# Altium schematic sheet FiringBoard.SchDoc
size B; PageSetup: Record=PageOptions|CenterHorizontal=True|CenterVertical=True|PrintScale=0.72|XCorrection=1.00|YCorrection=1.00|PrintKind=0|BorderSize=5000000|LeftOffset=0|BottomOffset=0|Orientation=2|PaperLength=1000|PaperWidth=1000|Scale=100|PaperSource=7|PrintQuality=-4|MediaType=1|DitherType=10|PaperKind=Letter|PrintScaleMode=1
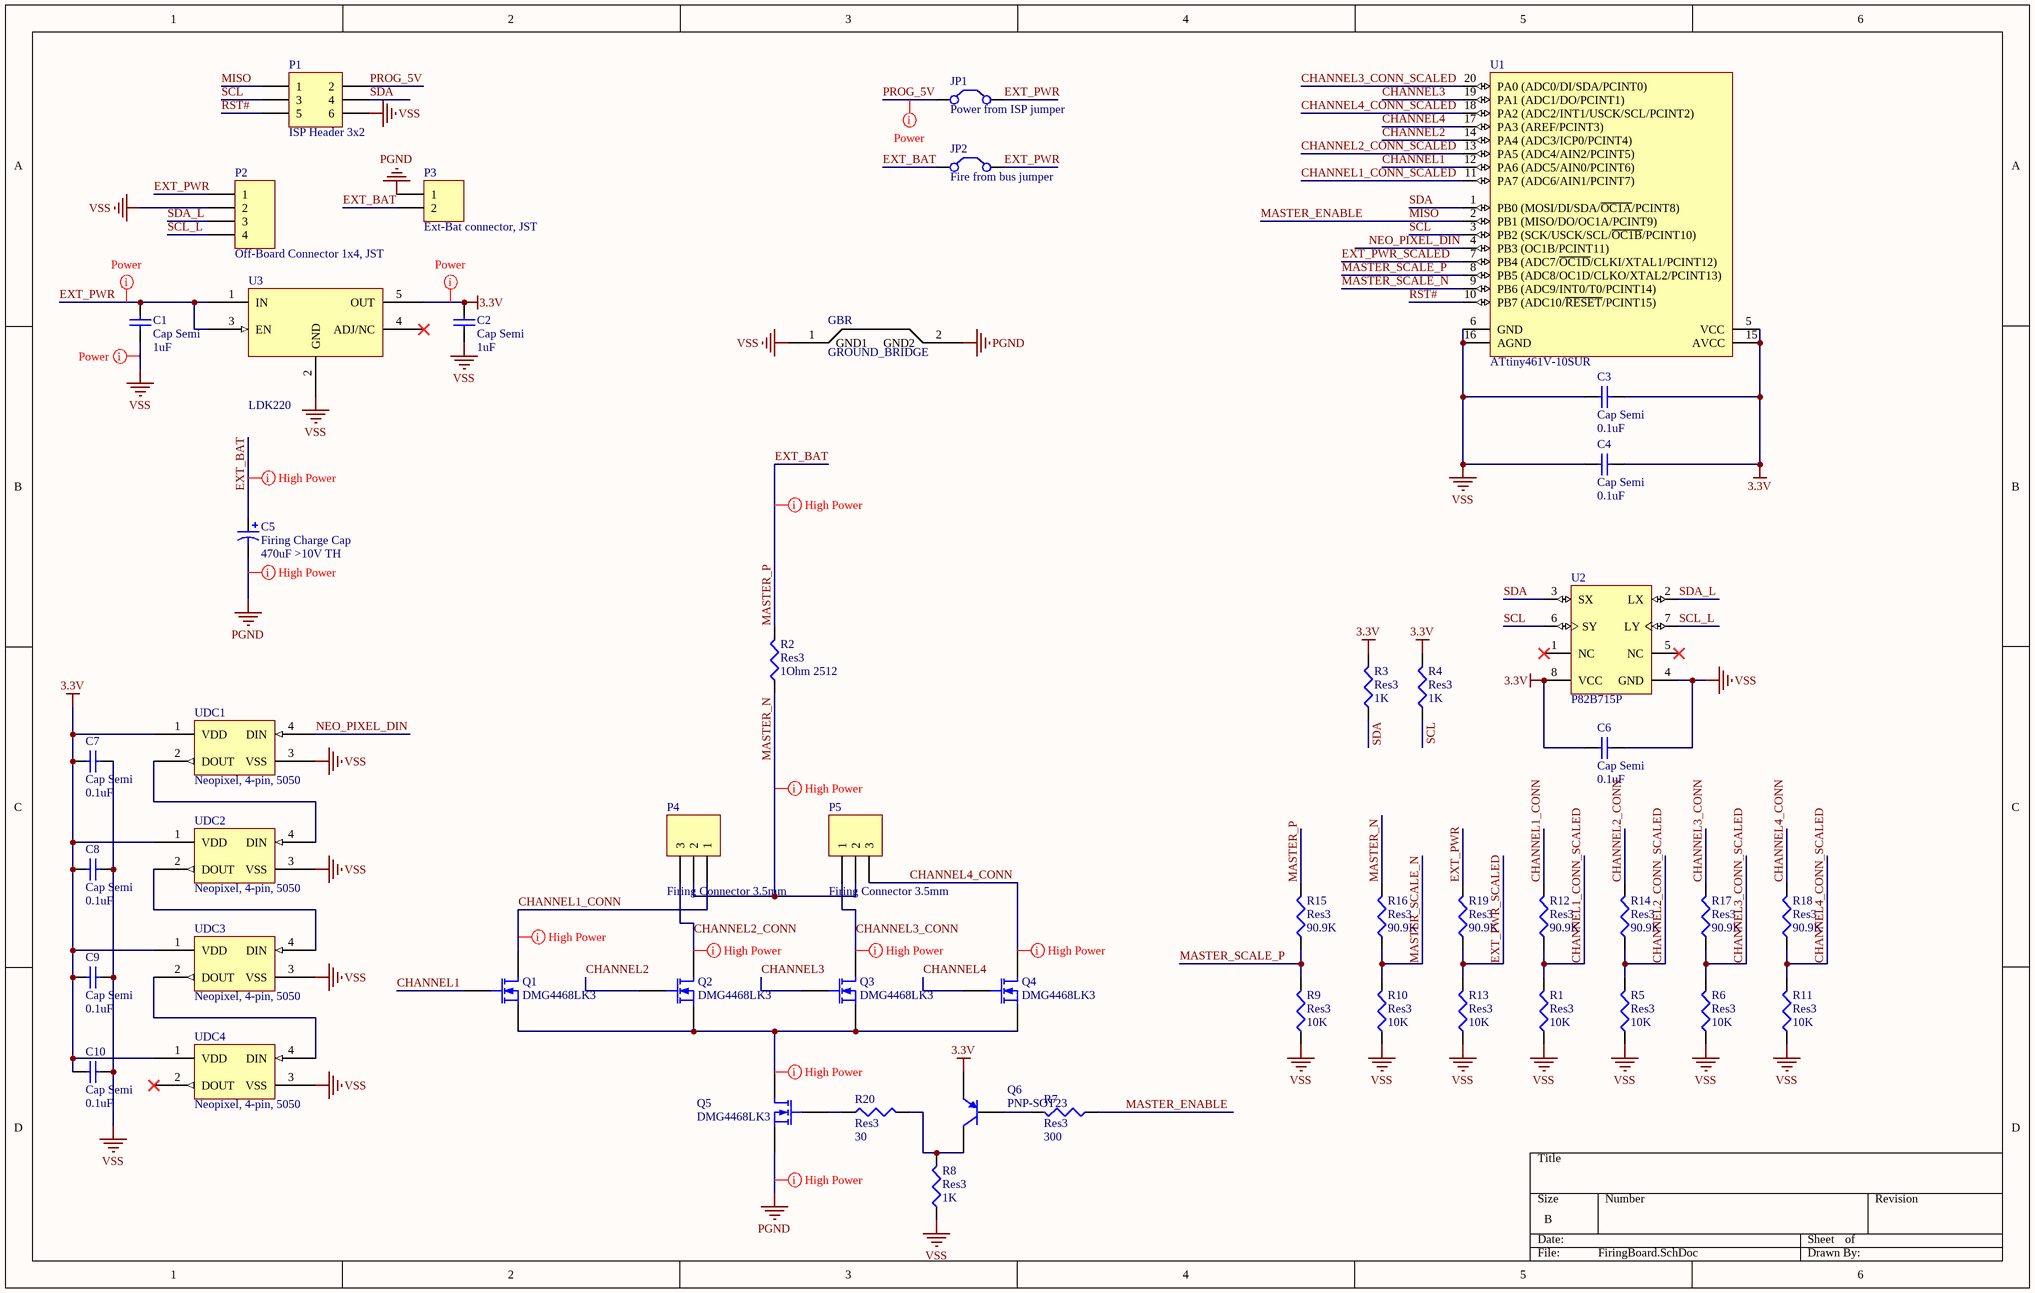
[diagram p0: FiringBoard.SchDoc]

## Parts
C1  Cap Semi  value 1uF  [C0603]
C2  Cap Semi  value 1uF  [C0603]
C3  Cap Semi  value 0.1uF  [C0603]
C4  Cap Semi  value 0.1uF  [C0603]
C5  Firing Charge Cap  value 470uF >10V TH  [CAPPR-10x12.5-Flat-Right]
C6  Cap Semi  value 0.1uF  [C0603]
C7  Cap Semi  value 0.1uF  [C0603]
C8  Cap Semi  value 0.1uF  [C0603]
C9  Cap Semi  value 0.1uF  [C0603]
C10  Cap Semi  value 0.1uF  [C0603]
GBR  GROUND_BRIDGE  [GROUND_BRIDGE]  (net tie, no BOM)
JP1  Power from ISP jumper  [SOLDER-JUMPER-3D]
JP2  Fire from bus jumper  [SOLDER-JUMPER-3D]
P1  ISP Header 3x2  [HDR2X3-AVRISP]
P2  Off-Board Connector 1x4, JST  [1x04-1.5MM-JST]
P3  Ext-Bat connector, JST  [JST-2-PTH-NS]
P4  Firing Connector 3.5mm  [20020327-C031B01LF]
P5  Firing Connector 3.5mm  [20020327-C031B01LF]
Q1  DMG4468LK3  [TO252]
Q2  DMG4468LK3  [TO252]
Q3  DMG4468LK3  [TO252]
Q4  DMG4468LK3  [TO252]
Q5  DMG4468LK3  [TO252]
Q6  PNP-SOT23  [SOT-23B_N]
R1  Res3  value 10K  [R0603-3D]
R2  Res3  value 1Ohm 2512  [R2512]
R3  Res3  value 1K  [R0603-3D]
R4  Res3  value 1K  [R0603-3D]
R5  Res3  value 10K  [R0603-3D]
R6  Res3  value 10K  [R0603-3D]
R7  Res3  value 300  [R0603-3D]
R8  Res3  value 1K  [R0603-3D]
R9  Res3  value 10K  [R0603-3D]
R10  Res3  value 10K  [R0603-3D]
R11  Res3  value 10K  [R0603-3D]
R12  Res3  value 90.9K  [R0603-3D]
R13  Res3  value 10K  [R0603-3D]
R14  Res3  value 90.9K  [R0603-3D]
R15  Res3  value 90.9K  [R0603-3D]
R16  Res3  value 90.9K  [R0603-3D]
R17  Res3  value 90.9K  [R0603-3D]
R18  Res3  value 90.9K  [R0603-3D]
R19  Res3  value 90.9K  [R0603-3D]
R20  Res3  value 30  [R0603-3D]
U1  ATtiny461V-10SUR  [20S2_M]
U2  P82B715P  [SO-G8]
U3  LDK220  [SO-G5/P.95]
UDC1  Neopixel, 4-pin, 5050  [LED5050]
UDC2  Neopixel, 4-pin, 5050  [LED5050]
UDC3  Neopixel, 4-pin, 5050  [LED5050]
UDC4  Neopixel, 4-pin, 5050  [LED5050]

## Nets
3.3V: C2.2 C3.2 C4.2 C6.1 C7.2 C8.2 C9.2 C10.2 Q6.2(E) R3.2 R4.2 U1.5(VCC) U1.15(AVCC) U2.8(VCC) U3.5(OUT) UDC1.1(VDD) UDC2.1(VDD) UDC3.1(VDD) UDC4.1(VDD)
PGND: C5.2 GBR.2(GND2) P3.1 Q5.2(S)
VSS: C1.1 C2.1 C3.1 C4.1 C6.2 C7.1 C8.1 C9.1 C10.1 GBR.1(GND1) P1.6 P2.2 R1.1 R5.1 R6.1 R8.1 R9.1 R10.1 R11.1 R13.1 U1.6(GND) U1.16(AGND) U2.4(GND) U3.2(GND) UDC1.3(VSS) UDC2.3(VSS) UDC3.3(VSS) UDC4.3(VSS)
CHANNEL1: Q1.1(G) U1.12(PA6_(ADC5/AIN0/PCINT6))
CHANNEL1_CONN: P4.1 Q1.3(D) R12.2
CHANNEL1_CONN_SCALED: R1.2 R12.1 U1.11(PA7_(ADC6/AIN1/PCINT7))
CHANNEL2: Q2.1(G) U1.14(PA4_(ADC3/ICP0/PCINT4))
CHANNEL2_CONN: P4.3 Q2.3(D) R14.2
CHANNEL2_CONN_SCALED: R5.2 R14.1 U1.13(PA5_(ADC4/AIN2/PCINT5))
CHANNEL3: Q3.1(G) U1.19(PA1_(ADC1/DO/PCINT1))
CHANNEL3_CONN: P5.1 Q3.3(D) R17.2
CHANNEL3_CONN_SCALED: R6.2 R17.1 U1.20(PA0_(ADC0/DI/SDA/PCINT0))
CHANNEL4: Q4.1(G) U1.17(PA3_(AREF/PCINT3))
CHANNEL4_CONN: P5.3 Q4.3(D) R18.2
CHANNEL4_CONN_SCALED: R11.2 R18.1 U1.18(PA2_(ADC2/INT1/USCK/SCL/PCINT2))
EXT_BAT: C5.1 JP2.1(C1) P3.2 R2.2 R15.2  [also labelled MASTER_P]
EXT_PWR: C1.2 JP1.2(C2) JP2.2(C2) P2.1 R19.2 U3.1(IN) U3.3(EN)
EXT_PWR_SCALED: R13.2 R19.1 U1.7(PB4_(ADC7/~{OC1D}/CLKI/XTAL1/PCINT12))
MASTER_ENABLE: P1.1 R7.1 U1.2(PB1_(MISO/DO/OC1A/PCINT9))  [also labelled MISO]
MASTER_N: P4.2 P5.2 R2.1 R16.2
MASTER_SCALE_N: R10.2 R16.1 U1.9(PB6_(ADC9/INT0/T0/PCINT14))
MASTER_SCALE_P: R9.2 R15.1 U1.8(PB5_(ADC8/OC1D/CLKO/XTAL2/PCINT13))
NEO_PIXEL_DIN: U1.4(PB3_(OC1B/PCINT11)) UDC1.4(DIN)
PROG_5V: JP1.1(C1) P1.2
RST#: P1.5 U1.10(PB7_(ADC10/~{RESET}/PCINT15))
SCL: P1.3 R4.1 U1.3(PB2_(SCK/USCK/SCL/~{OC1B}/PCINT10)) U2.6(SY)
SCL_L: P2.4 U2.7(LY)
SDA: P1.4 R3.1 U1.1(PB0_(MOSI/DI/SDA/~{OC1A}/PCINT8)) U2.3(SX)
SDA_L: P2.3 U2.2(LX)
NetQ1_2: Q1.2(S) Q2.2(S) Q3.2(S) Q4.2(S) Q5.3(D)
NetQ5_1: Q5.1(G) R20.1
NetQ6_1: Q6.1(B) R7.2
NetQ6_3: Q6.3(C) R8.2 R20.2
NetUDC1_2: UDC1.2(DOUT) UDC2.4(DIN)
NetUDC2_2: UDC2.2(DOUT) UDC3.4(DIN)
NetUDC3_2: UDC3.2(DOUT) UDC4.4(DIN)

Not connected (* = marked no-connect by the designer): U2 1(NC)* 5(NC)*; U3 4(ADJ/NC)*; UDC4 2(DOUT)*

## Layout directives
net class High Power: CHANNEL1_CONN, CHANNEL2_CONN, CHANNEL3_CONN, CHANNEL4_CONN, EXT_BAT, MASTER_N, NetQ1_2, PGND
net class Power: 3.3V, EXT_PWR, PROG_5V, VSS

## Library data of the parts
C1-C4 C6-C10 = Cap Semi: Capacitor (Semiconductor SIM Model); Published: 8-Jun-2000; LatestRevisionDate: 29-May-2009; LatestRevisionNote: IPC-7351 Footprint Added.; PackageReference: C1206; Publisher: Altium Limited; PackageDescription: Chip Capacitor
C5 = Cap Pol1: Polarized Capacitor (Radial); Published: 8-Jun-2000; LatestRevisionDate: 17-Jul-2002; LatestRevisionNote: Re-released for DXP Platform.; PackageReference: RB7.6-15; Publisher: Altium Limited; PackageDescription: Polarized Capacitor (Radial); 2 Leads
JP1 JP2 = SolderJumper: Solder Configuration Jumper; Published: 24-Mar-1999; LatestRevisionDate: 17-Jul-2002; LatestRevisionNote: Re-released for DXP Platform.; PackageReference: RAD-0.2; Publisher: Altium Limited; PackageDescription: Radial Cap, Thru-Hole; 2 Leads; 0.2 in Pin Spacing
P1 = Header 3X2: Header, 3-Pin, Dual row; LatestRevisionDate: 17-Jul-2002; LatestRevisionNote: Re-released for DXP Platform.; Publisher: Altium Limited
P2 = Header 4: Header, 4-Pin; LatestRevisionDate: 17-Jul-2002; LatestRevisionNote: Re-released for DXP Platform.; Publisher: Altium Limited
P3 = Header 2: Header, 2-Pin; LatestRevisionDate: 17-Jul-2002; LatestRevisionNote: Re-released for DXP Platform.; Publisher: Altium Limited
P4 P5 = Header 3: Header, 3-Pin; LatestRevisionDate: 17-Jul-2002; LatestRevisionNote: Re-released for DXP Platform.; Publisher: Altium Limited
Q1-Q5 = DMG4468LK3: N-CHANNEL ENHANCEMENT MODE MOSFET; LatestRevisionDate: 17-Jul-2002; LatestRevisionNote: Re-released for DXP Platform.; PackageVersion: 1995/1996; PackageReference: E3; PackageDescription: TO252
Q6 = PNP-SOT23: PNP Bipolar Transistor - SOT23; Published: 8-Jun-2000; LatestRevisionDate: 29-May-2009; LatestRevisionNote: IPC-7351 Footprint Added.; PackageVersion: Aug-1999; PackageReference: SOT-23B; Publisher: Altium Limited; PackageDescription: 3-Pin SOT-23 Package 0.95 mm Pitch, 2.4 mm Lead Span
R1-R20 = Res3: Resistor; Published: 8-Jun-2000; LatestRevisionDate: 29-May-2009; LatestRevisionNote: IPC-7351 Footprint Added.; PackageReference: J1-0603; Publisher: Altium Limited; PackageDescription: Chip Resistor
U1 = CMP-0093-00289-1: 8-bit AVR Microcontroller, 1.8-5.5V, 10MHz, 4KB Flash, 256 Bytes EEPROM, 256 Bytes SRAM, 20-pin SOIC, Industrial Grade (-40°C to 85°C), Reel; ComponentLink1URL: http://www.atmel.com/; ComponentLink1Description: Manufacturer URL; PackageDescription: 20-lead, 0.300" Wide Body, Plastic Gull Wing Small Outline Package (SOIC); DatasheetVersion: revE, Aug-2010; ComponentLink2Description: ATtiny261/461/861 Datasheet; Code_IPC: SOIC127P1030-20; ComponentLink3URL: http://www.atmel.com/dyn/resources/prod_documents/2588S.pdf; PackageReference: 20S2; PackageVersion: revB, Nov-2006; ComponentLink3Description: ATtiny261/461/861 Summary; ComponentLink2URL: http://www.atmel.com/dyn/resources/prod_documents/doc2588.pdf; Code_JEDEC: MS-013-AC
U2 = CMP-0314-00015-1: I2C Bus Extender, 2 Channel Width, 3.0 to 12.0 V, -40 to 85 degC, 8-pin PDIP (P), Pb-Free (RoHS); Manufacturer: Texas Instruments; Channel Width: 2; Open Drain I/O Type: Yes; VCC(Min)(V): 3; VCC(Max)(V): 12; Eco-Plan: Green (RoHS & no Sb/Br); SubFamily: I2C Hub, Buffer, Repeater; Master Side I2C Bus Capacitance Supported(pF): 400; ComponentLink1Description: Datasheet; PackageDescription: 8-Pin Plastic Dual-In-Line Package, Row Spacing 7.62 mm, Pitch 2.54 mm; Mounting Technology: Through-hole; PartNumber: P82B715P; DatasheetVersion: SCPS145A; Vcc range(V): 3.0 to 12.0; ComponentLink2URL: http://www.ti.com/litv/pdf/mpdi001b; PackageVersion: revE, Apr-2010; PackageReference: P8; ComponentLink2Description: Package Specification; 5V Tolerant I/O: Yes; ComponentLink1URL: http://www.ti.com/general/docs/lit/getliterature.tsp?genericPartNumber=P82B715&fileType=pdf; Max Frequency(kHz): 400; Code_JEDEC: MS-001-BA; Slave Side I2C Bus Capacitance Supported(pF): 400
U3 = LDK220: 200 mA low quiescent current and low noise LDO
UDC1-UDC4 = WS2812B